# Altium schematic sheet Sheet1.SchDoc
size A4
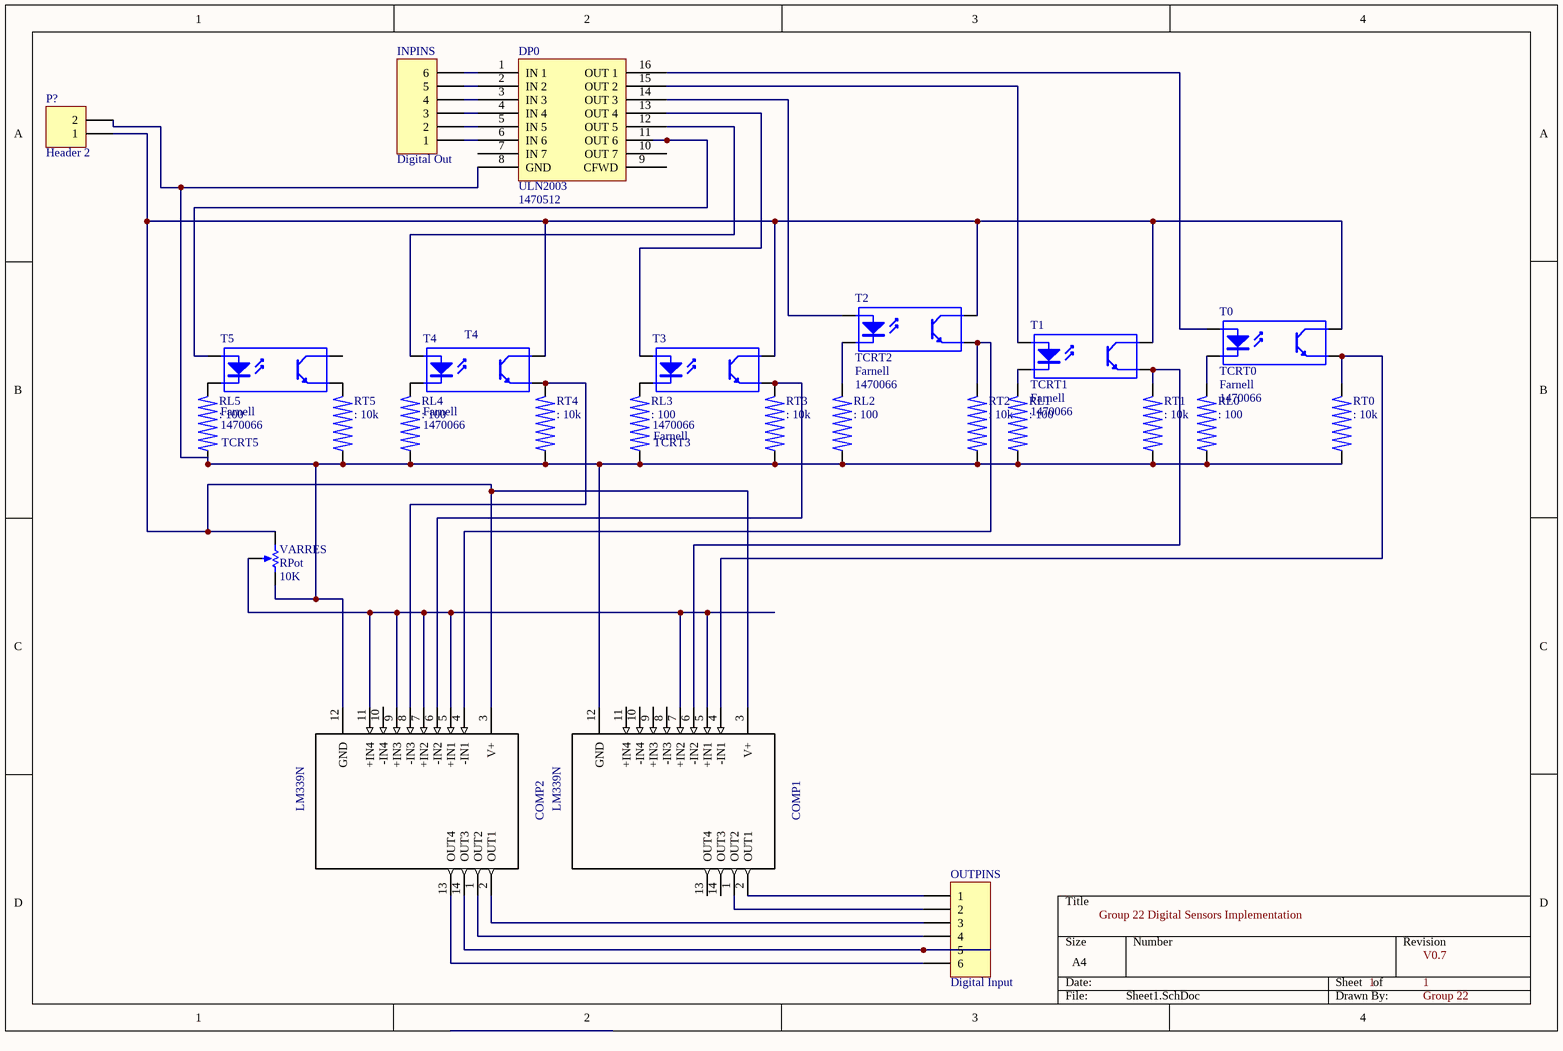
[diagram p0: Sheet1.SchDoc]

## Parts
COMP1  LM339N  [DIP254P762X508-14]
COMP2  LM339N  [DIP254P762X508-14]
DP0  ULN2003  Supplier Part Number 1: 1470512  [DILP-16(300) - 3D]
INPINS  Digital Out  [PROGRAMMING-HEADER-MICRO]
OUTPINS  Digital Input  [PROGRAMMING-HEADER-MICRO]
P?  Header 2  [HDR1X2]
RL0  Resistor (IO board)  [RESISTOR_10K_TH_QW]  (value not drawn)
RL1  Resistor (IO board)  [RESISTOR_10K_TH_QW]  (value not drawn)
RL2  Resistor (IO board)  [RESISTOR_10K_TH_QW]  (value not drawn)
RL3  Resistor (IO board)  [RESISTOR_10K_TH_QW]  (value not drawn)
RL4  Resistor (IO board)  [RESISTOR_10K_TH_QW]  (value not drawn)
RL5  Resistor (IO board)  [RESISTOR_10K_TH_QW]  (value not drawn)
RT0  Resistor (IO board)  [RESISTOR_10K_TH_QW]  (value not drawn)
RT1  Resistor (IO board)  [RESISTOR_10K_TH_QW]  (value not drawn)
RT2  Resistor (IO board)  [RESISTOR_10K_TH_QW]  (value not drawn)
RT3  Resistor (IO board)  [RESISTOR_10K_TH_QW]  (value not drawn)
RT4  Resistor (IO board)  [RESISTOR_10K_TH_QW]  (value not drawn)
RT5  Resistor (IO board)  [RESISTOR_10K_TH_QW]  (value not drawn)
T0  TCRT0  Supplier 1: Farnell  Supplier Part Number 1: 1470066  [TCRT5000 Breakout]
T1  TCRT1  Supplier 1: Farnell  Supplier Part Number 1: 1470066  [TCRT5000 Breakout]
T2  TCRT2  Supplier 1: Farnell  Supplier Part Number 1: 1470066  [TCRT5000 Breakout]
T3  TCRT3  Supplier 1: Farnell  Supplier Part Number 1: 1470066  [TCRT5000 Breakout]
T4  T4  Supplier 1: Farnell  Supplier Part Number 1: 1470066  [TCRT5000 Breakout]
T5  TCRT5  Supplier 1: Farnell  Supplier Part Number 1: 1470066  [TCRT5000 Breakout]
VARRES  RPot  value 10K  [VR5]

## Nets
NetCOMP1_1: COMP1.1(OUT2) OUTPINS.2
NetCOMP1_2: COMP1.2(OUT1) OUTPINS.1
NetCOMP1_3: COMP1.3(V+) COMP2.3(V+) P?.1 T0.4(C) T1.4(C) T2.4(C) T3.4(C) T4.4(C) VARRES.1(TOP)
NetCOMP1_4: COMP1.4(-IN1) RT0.2 T0.3(E)
NetCOMP1_5: COMP1.5(+IN1) COMP1.7(+IN2) COMP2.5(+IN1) COMP2.7(+IN2) COMP2.9(+IN3) COMP2.11(+IN4) VARRES.3(TAP)
NetCOMP1_6: COMP1.6(-IN2) RT1.2 T1.3(E)
NetCOMP1_12: COMP1.12(GND) COMP2.12(GND) DP0.8(GND) P?.2 RL0.1 RL1.1 RL2.1 RL3.1 RL4.1 RL5.1 RT0.1 RT1.1 RT2.1 RT3.1 RT4.1 RT5.1 VARRES.2(BOT)
NetCOMP2_1: COMP2.1(OUT2) OUTPINS.4
NetCOMP2_2: COMP2.2(OUT1) OUTPINS.3
NetCOMP2_4: COMP2.4(-IN1) RT2.2 T2.3(E)
NetCOMP2_6: COMP2.6(-IN2) RT3.2 T3.3(E)
NetCOMP2_8: COMP2.8(-IN3) RT4.2 T4.3(E)
NetCOMP2_13: COMP2.13(OUT4) OUTPINS.6
NetCOMP2_14: COMP2.14(OUT3) OUTPINS.5
NetDP0_1: DP0.1(IN_1) INPINS.6
NetDP0_2: DP0.2(IN_2) INPINS.5
NetDP0_3: DP0.3(IN_3) INPINS.4
NetDP0_4: DP0.4(IN_4) INPINS.3
NetDP0_5: DP0.5(IN_5) INPINS.2
NetDP0_6: DP0.6(IN_6) INPINS.1
NetDP0_11: DP0.11(OUT_6) T5.1(A)
NetDP0_12: DP0.12(OUT_5) T4.1(A)
NetDP0_13: DP0.13(OUT_4) T3.1(A)
NetDP0_14: DP0.14(OUT_3) T2.1(A)
NetDP0_15: DP0.15(OUT_2) T1.1(A)
NetDP0_16: DP0.16(OUT_1) T0.1(A)
NetRL0_2: RL0.2 T0.2(K)
NetRL1_2: RL1.2 T1.2(K)
NetRL2_2: RL2.2 T2.2(K)
NetRL3_2: RL3.2 T3.2(K)
NetRL4_2: RL4.2 T4.2(K)
NetRL5_2: RL5.2 T5.2(K)
NetRT5_2: RT5.2 T5.3(E)

Not connected (* = marked no-connect by the designer): COMP1 8(-IN3) 9(+IN3) 10(-IN4) 11(+IN4) 13(OUT4) 14(OUT3); COMP2 10(-IN4); DP0 7(IN_7) 9(CFWD) 10(OUT_7); T5 4(C)

## Notes on the sheet
- Labels drawn without touching a wire or pin: 1, Group 22, Group 22 Digital Sensors Implementation, V0.7
- (in symbol Resistor(IO board)) 100; 10k

## Library data of the parts
COMP1 COMP2 = LM339N: MF: ON; SnapEDA_Link: https://www.snapeda.com/parts/LM339N/ON%20Semiconductor/view-part/?ref=snap; Availability: Unavailable; Price: None; Package: DIP-14 RS Components; MP: LM339N; Value: *
DP0 = ULN2003: Darlington Transistor Array; Supplier 1: Farnell
INPINS OUTPINS = Header 6: Header, 6-Pin; LatestRevisionDate: 17-Jul-2002; LatestRevisionNote: Re-released for DXP Platform.; Publisher: Altium Limited
P? = Header 2: Header, 2-Pin; LatestRevisionDate: 17-Jul-2002; LatestRevisionNote: Re-released for DXP Platform.; Publisher: Altium Limited
RL0-RL5 RT0-RT5 = Resistor(IO board): Resistor (SFR25); Supplier: *; Part Number: *
T0-T5 = TCRT5000(On PCB): 4-Pin Phototransistor Optocoupler; pin to pad: 1>2 2>7 3>6 4>3; Published: 24-Mar-1999; LatestRevisionDate: 04-Mar-2005; LatestRevisionNote: Sch pins 3 & 4 Swapped.; DatasheetVersion: Nov-2003; PackageReference: DIP-4; Publisher: Altium Limited
VARRES = RPot: Potentiometer; Sim Note: Enter the Resistance value and the set point into parameter fields.; Set Position: 0.5; Published: 8-Jun-2000; LatestRevisionDate: 17-Jul-2002; LatestRevisionNote: Re-released for DXP Platform.; PackageReference: VR5; Publisher: Altium Limited; PackageDescription: Variable Resistor, Thru-Hole; 3 Leads